# Altium schematic sheet DRV8833_Motordrive.SchDoc
size A4; SheetNumber: 2; SheetTotal: 4
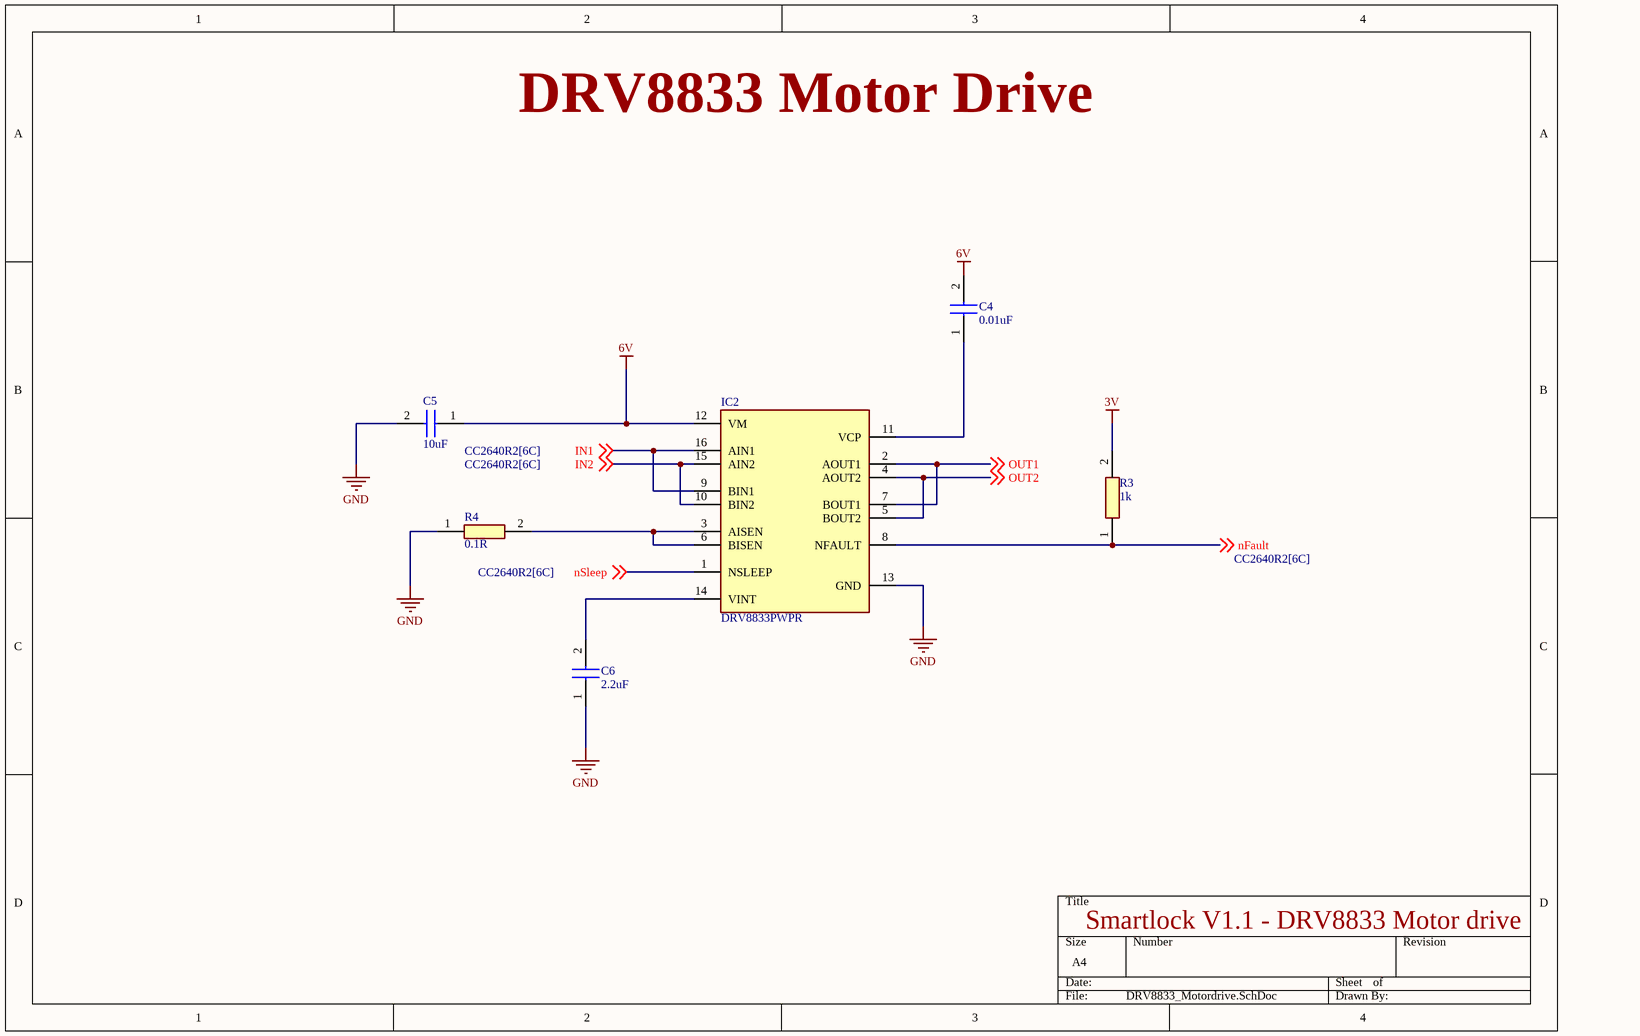
[diagram p0: DRV8833_Motordrive.SchDoc]

## Parts
C4  0.01uF  [CAPC1005X55N]
C5  10uF  [CAPC2114X145N]
C6  2.2uF  [C0603]
IC2  DRV8833PWPR  [SOP65P640X120-16N]
R3  1k  [RESC1608X55N]
R4  0.1R  [CSR1206]

## Nets
3V: R3.2
6V: C4.2 C5.1 IC2.12(VM)
GND: C5.2 C6.1 IC2.13(GND) R4.1
IN1: IC2.9(BIN1) IC2.16(AIN1) ; off-sheet IN1
IN2: IC2.10(BIN2) IC2.15(AIN2) ; off-sheet IN2
nFault: IC2.8(NFAULT) R3.1 ; off-sheet nFault
nSleep: IC2.1(NSLEEP) ; off-sheet nSleep
OUT1: IC2.2(AOUT1) IC2.7(BOUT1) ; off-sheet OUT1
OUT2: IC2.4(AOUT2) IC2.5(BOUT2) ; off-sheet OUT2
NetC4_1: C4.1 IC2.11(VCP)
NetC6_2: C6.2 IC2.14(VINT)
NetIC2_3: IC2.3(AISEN) IC2.6(BISEN) R4.2

## Notes on the sheet
- DRV8833 Motor Drive
- Smartlock V1.1 - DRV8833 Motor drive

## Library data of the parts
C4 = C1005X7R1C103K050BA: Capacitor,0.01uF; Manufacturer_Name: TDK; Datasheet Link: https://product.tdk.com/info/en/catalog/datasheets/mlcc_commercial_midvoltage_en.pdf; Height: 0.55mm; Manufacturer_Part_Number: C1005X7R1C103K050BA; Mouser Part Number: 810-C1005X7R1C103K; Mouser Price/Stock: https://www.mouser.co.uk/ProductDetail/TDK/C1005X7R1C103K050BA?qs=NRhsANhppD%252Bt7xPr32kpQA%3D%3D; Arrow Part Number: C1005X7R1C103K050BA; Arrow Price/Stock: https://www.arrow.com/en/products/c1005x7r1c103k050ba/tdk?region=nac
C5 = EMK212BB7106MG-T: Capacitor,10uF,16V X7R; Manufacturer_Name: TAIYO YUDEN; Datasheet Link: https://datasheet.datasheetarchive.com/originals/distributors/Datasheets-DGA20/25674.pdf; Height: 1.45mm; Manufacturer_Part_Number: EMK212BB7106MG-T; Mouser Part Number: 963-EMK212BB7106MG-T; Mouser Price/Stock: https://www.mouser.co.uk/ProductDetail/TAIYO-YUDEN/EMK212BB7106MG-T?qs=CNQs48zzdnoVUZzBq71rnA%3D%3D
C6 = C0603C225K9PACTU: Capacitor,2.2uF,X5R,6.3V; Manufacturer_Name: KEMET; Datasheet Link: https://content.kemet.com/datasheets/KEM_C1006_X5R_SMD.pdf; Height: 0.87mm; Manufacturer_Part_Number: C0603C225K9PACTU; Mouser Part Number: 80-C0603C225K9P; Mouser Price/Stock: https://www.mouser.co.uk/ProductDetail/KEMET/C0603C225K9PACTU?qs=k9TrThuu1pdUHTgQc%252B%2FY%252Bg%3D%3D; Arrow Part Number: C0603C225K9PACTU; Arrow Price/Stock: https://www.arrow.com/en/products/c0603c225k9pactu/kemet-corporation?region=nac
IC2 = DRV8833PWPR: Integrated Circuit; Manufacturer_Name: Texas Instruments; Datasheet Link: http://www.ti.com/lit/gpn/drv8833; Height: 1.2mm; Manufacturer_Part_Number: DRV8833PWPR; Mouser Part Number: 595-DRV8833PWPR; Mouser Price/Stock: https://www.mouser.co.uk/ProductDetail/Texas-Instruments/DRV8833PWPR?qs=luhu8ESwuKxT62RV9jrJTg%3D%3D; Arrow Part Number: DRV8833PWPR; Arrow Price/Stock: https://www.arrow.com/en/products/drv8833pwpr/texas-instruments?utm_currency=USD&region=europe
R3 = ERJ-3EKF3002V: Resistor,1k; Manufacturer_Name: Panasonic; Datasheet Link: http://industrial.panasonic.com/cdbs/www-data/pdf/RDA0000/AOA0000C86.pdf; Height: 0.55mm; Manufacturer_Part_Number: ERJ-3EKF3002V; Mouser Part Number: 667-ERJ-3EKF3002V; Mouser Price/Stock: https://www.mouser.co.uk/ProductDetail/Panasonic/ERJ-3EKF3002V?qs=MVjVSMjNRMoByeEjjMcfzA%3D%3D; Arrow Part Number: ERJ-3EKF3002V; Arrow Price/Stock: https://www.arrow.com/en/products/erj3ekf3002v/panasonic?region=nac
R4 = CSR1206FKR100: Resistor,0.1R; Manufacturer_Name: Stackpole Electronics; Datasheet Link: https://cs.seielect.com/catalog/SEI-CSR_CSRN.pdf; Height: 0.65mm; Manufacturer_Part_Number: CSR1206FKR100; Mouser Part Number: 708-CSR1206FKR100; Mouser Price/Stock: https://www.mouser.co.uk/ProductDetail/SEI-Stackpole/CSR1206FKR100?qs=FESYatJ8odJJ%2Fwfc%252BjDDcQ%3D%3D